# Altium schematic sheet CPU_PCIE_USB_HDMI_EXT_PCIEX2_mPCIeX2.SchDoc
size 594 x 420 mm; Scale: 1:1; DocumentType: Схема электрическая принципиальная; SheetNumber: 26; SheetTotal: 32; DocumentTypeShort: Э3; DocumentInvertoryNumber: ㅤ
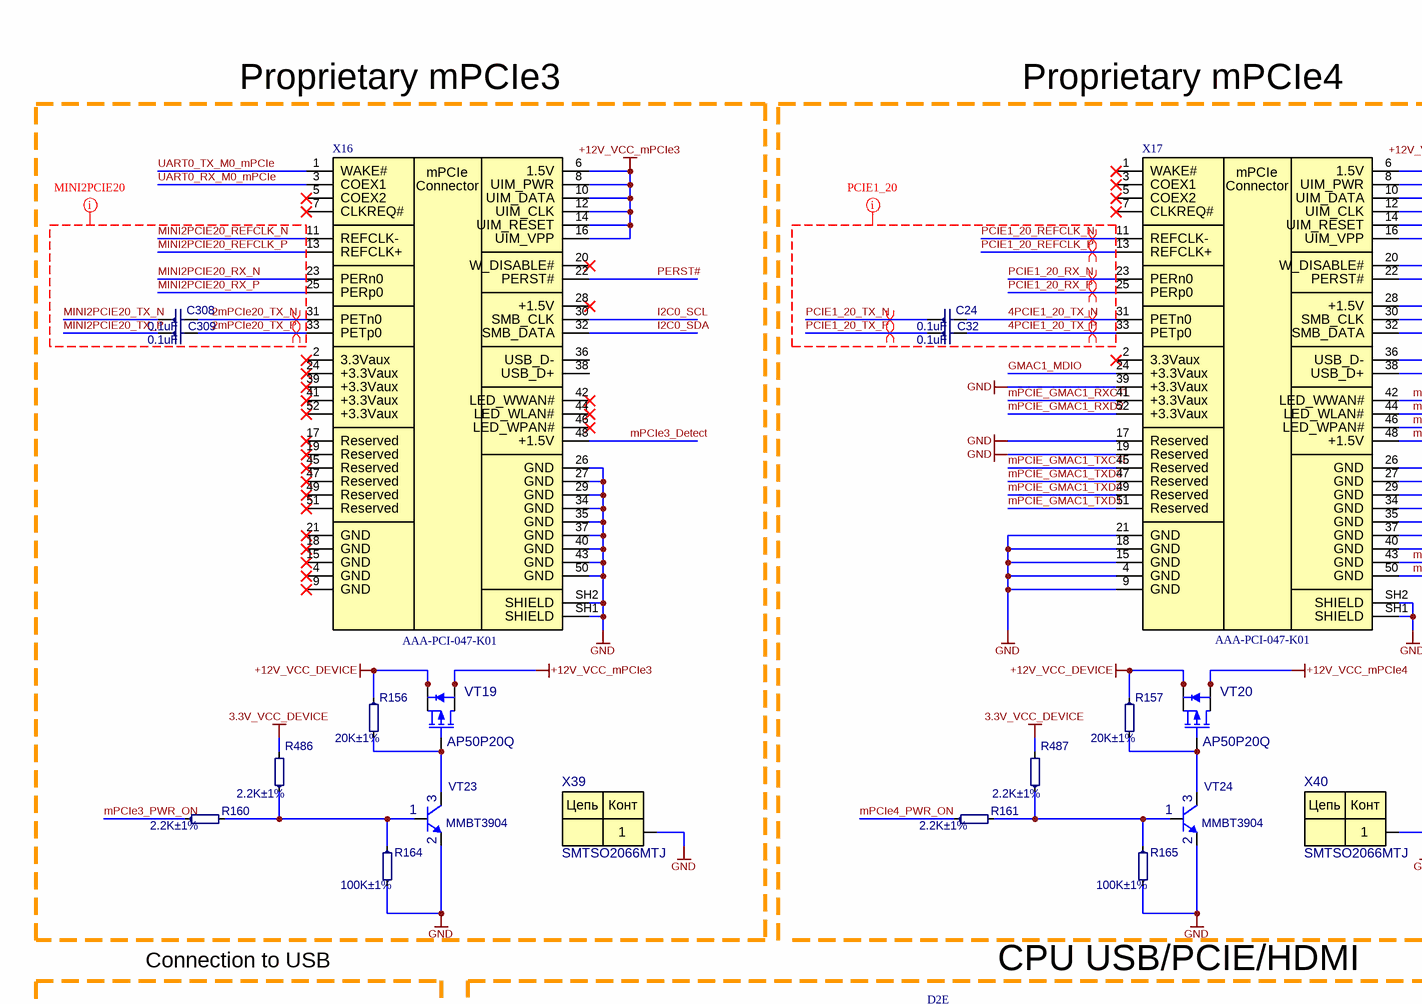
[diagram p0: CPU_PCIE_USB_HDMI_EXT_PCIEX2_mPCIeX2.SchDoc, top left]
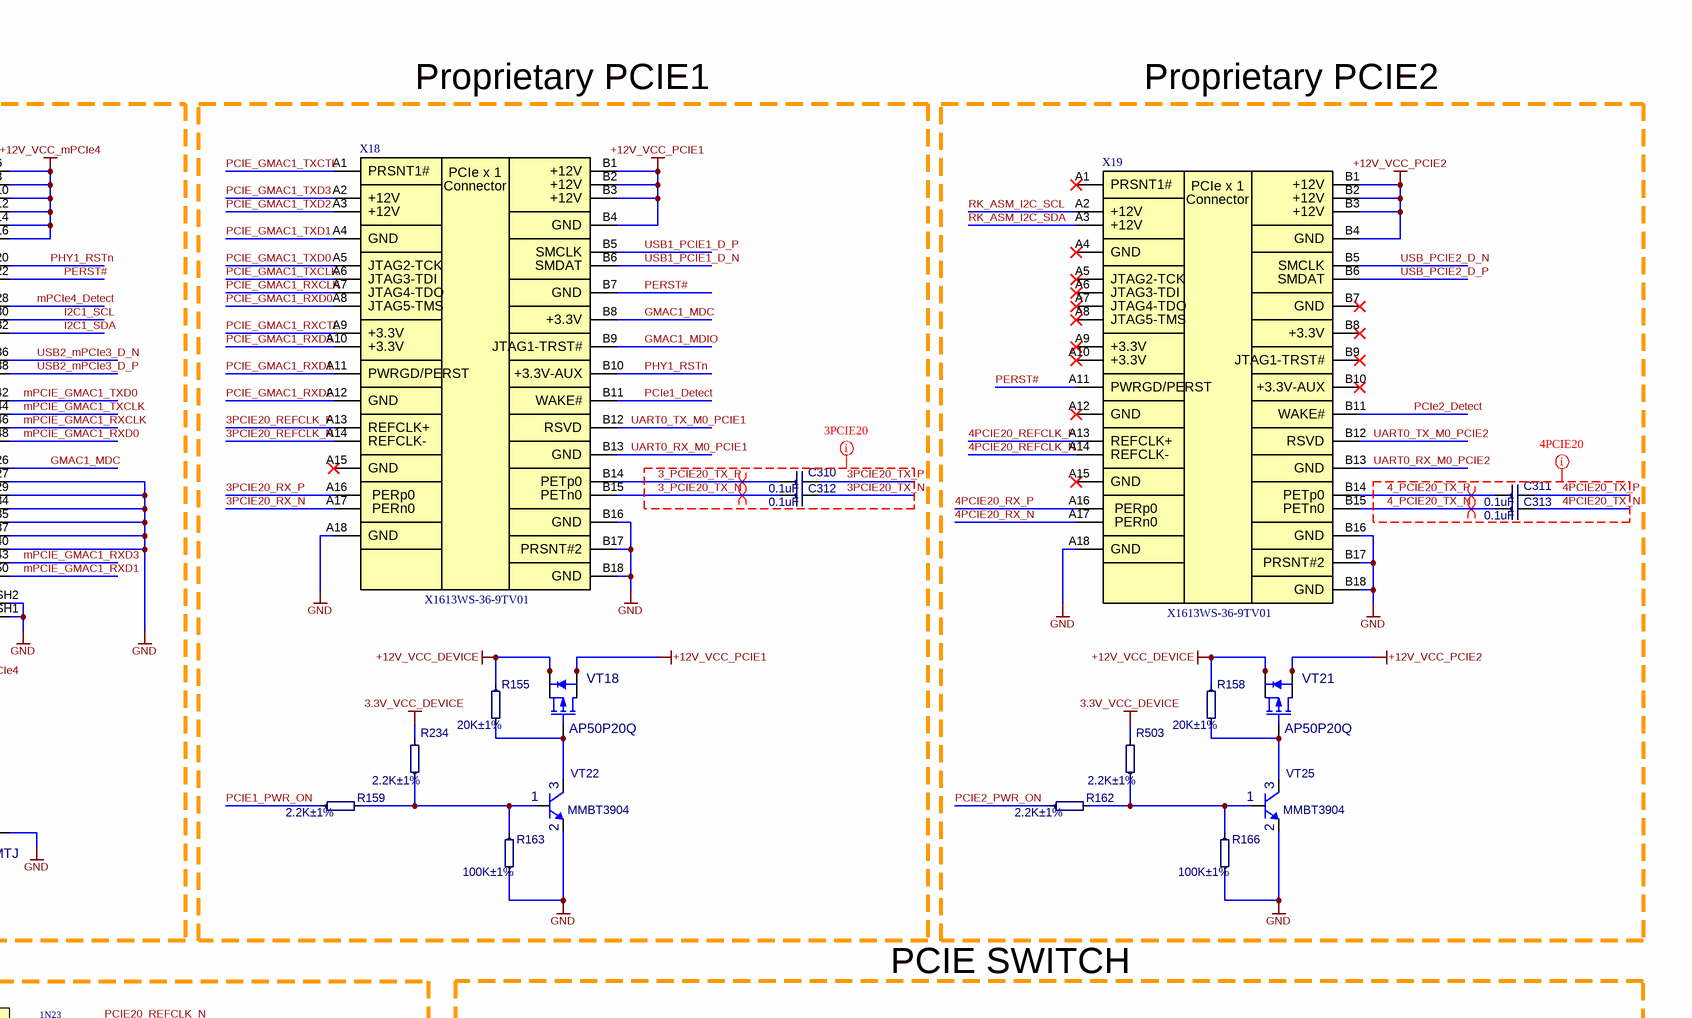
[diagram p1: CPU_PCIE_USB_HDMI_EXT_PCIEX2_mPCIeX2.SchDoc, top right]
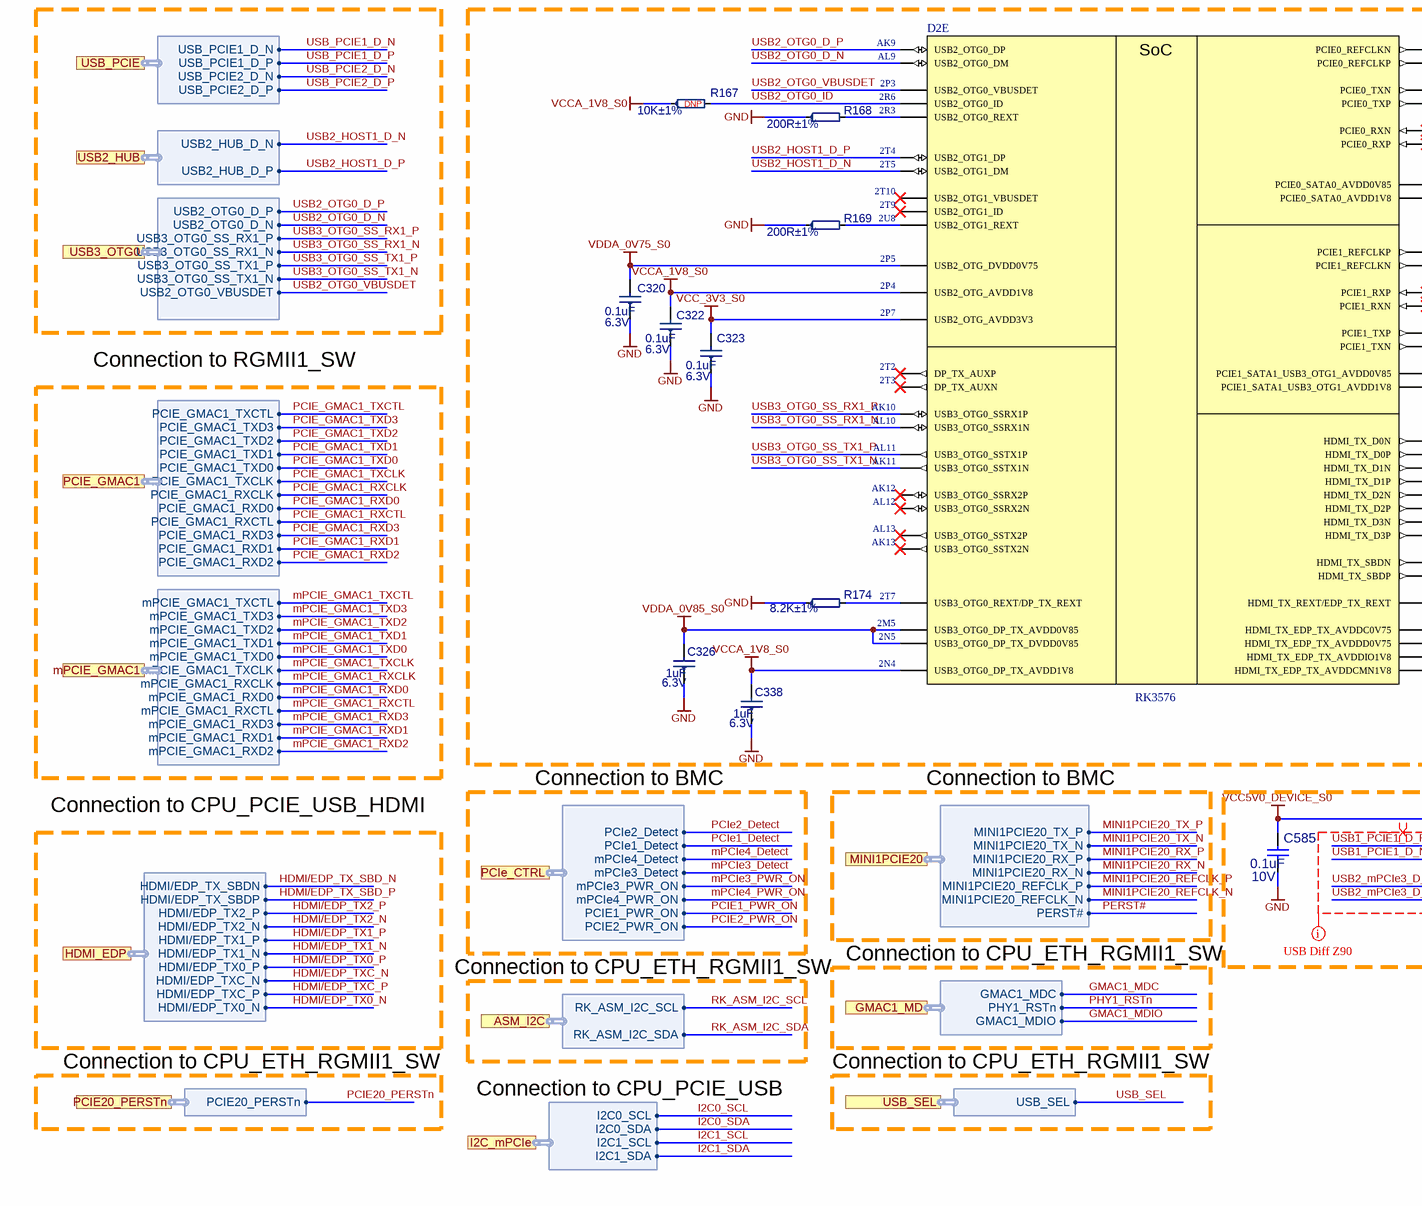
[diagram p2: CPU_PCIE_USB_HDMI_EXT_PCIEX2_mPCIeX2.SchDoc, bottom left]
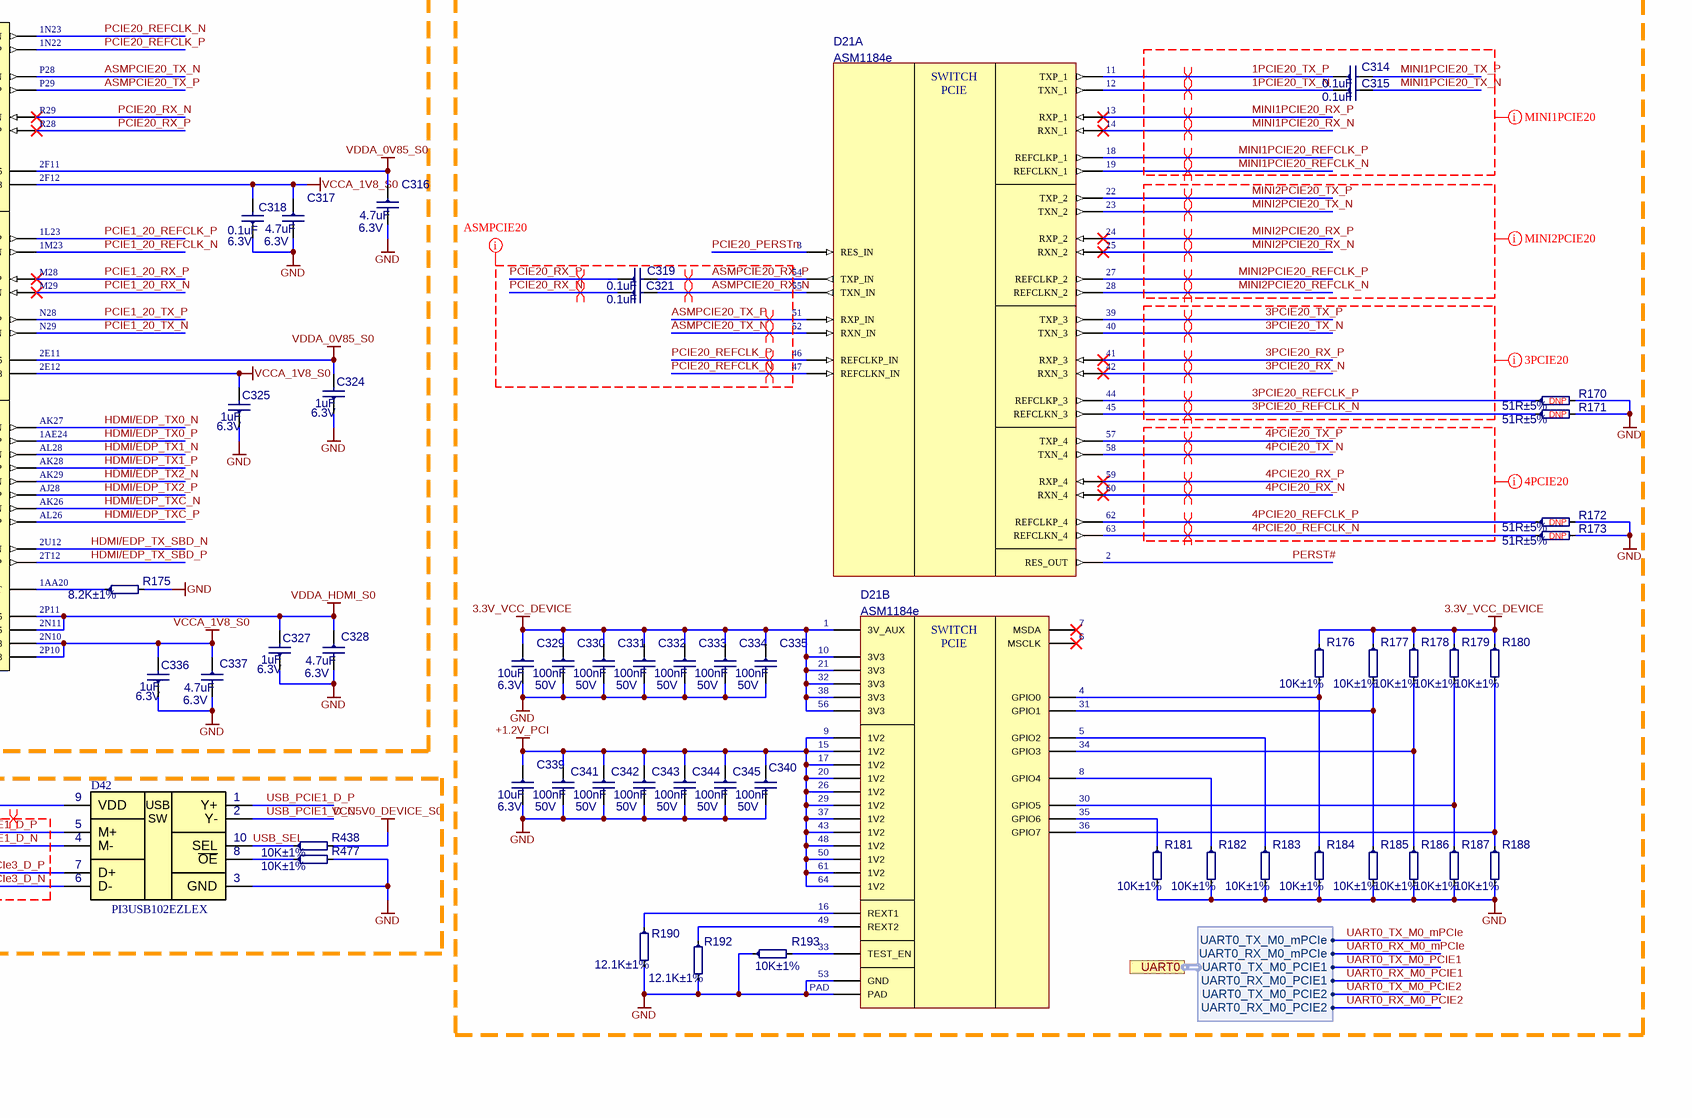
[diagram p3: CPU_PCIE_USB_HDMI_EXT_PCIEX2_mPCIeX2.SchDoc, bottom right]

## Parts
C24  0.1uF  [C0201]
C32  0.1uF  [C0201]
C308  0.1uF  [C0201]
C309  0.1uF  [C0201]
C310  0.1uF  [C0201]
C311  0.1uF  [C0201]
C312  0.1uF  [C0201]
C313  0.1uF  [C0201]
C314  0.1uF  [C0201]
C315  0.1uF  [C0201]
C316  4.7uF  Voltage: 6.3V  [C0201]
C317  4.7uF  Voltage: 6.3V  [C0201]
C318  0.1uF  Voltage: 6.3V  [C0201]
C319  0.1uF  [C0201]
C320  0.1uF  Voltage: 6.3V  [C0201]
C321  0.1uF  [C0201]
C322  0.1uF  Voltage: 6.3V  [C0201]
C323  0.1uF  Voltage: 6.3V  [C0201]
C324  1uF  Voltage: 6.3V  [C0201]
C325  1uF  Voltage: 6.3V  [C0201]
C326  1uF  Voltage: 6.3V  [C0201]
C327  1uF  Voltage: 6.3V  [C0201]
C328  4.7uF  Voltage: 6.3V  [C0201]
C329  10uF  Voltage: 6.3V  [C0402]
C330  100nF  Voltage: 50V  [C0402]
C331  100nF  Voltage: 50V  [C0402]
C332  100nF  Voltage: 50V  [C0402]
C333  100nF  Voltage: 50V  [C0402]
C334  100nF  Voltage: 50V  [C0402]
C335  100nF  Voltage: 50V  [C0402]
C336  1uF  Voltage: 6.3V  [C0201]
C337  4.7uF  Voltage: 6.3V  [C0201]
C338  1uF  Voltage: 6.3V  [C0201]
C339  10uF  Voltage: 6.3V  [C0402]
C340  100nF  Voltage: 50V  [C0402]
C341  100nF  Voltage: 50V  [C0402]
C342  100nF  Voltage: 50V  [C0402]
C343  100nF  Voltage: 50V  [C0402]
C344  100nF  Voltage: 50V  [C0402]
C345  100nF  Voltage: 50V  [C0402]
C585  0.1uF  Voltage: 10V  [C0402]
D2  RK3576  [BGAFCCSP698L]  (part E of 7)
D21  ASM1184e  [QFN50X90X90X09-64T75x75]  (parts A,B of 2)
D42  PI3USB102EZLEX  [PI3USB102EZLEX]
R155  20K±1%  [R0402]
R156  20K±1%  [R0402]
R157  20K±1%  [R0402]
R158  20K±1%  [R0402]
R159  2.2K±1%  [R0402]
R160  2.2K±1%  [R0402]
R161  2.2K±1%  [R0402]
R162  2.2K±1%  [R0402]
R163  100K±1%  [R0402]
R164  100K±1%  [R0402]
R165  100K±1%  [R0402]
R166  100K±1%  [R0402]
R167  10K±1%  [R0402]
R168  200R±1%  [R0402]
R169  200R±1%  [R0402]
R170  51R±5%  [R0402]
R171  51R±5%  [R0402]
R172  51R±5%  [R0402]
R173  51R±5%  [R0402]
R174  8.2K±1%  [R0402]
R175  8.2K±1%  [R0402]
R176  10K±1%  [R0402]
R177  10K±1%  [R0402]
R178  10K±1%  [R0402]
R179  10K±1%  [R0402]
R180  10K±1%  [R0402]
R181  10K±1%  [R0402]
R182  10K±1%  [R0402]
R183  10K±1%  [R0402]
R184  10K±1%  [R0402]
R185  10K±1%  [R0402]
R186  10K±1%  [R0402]
R187  10K±1%  [R0402]
R188  10K±1%  [R0402]
R190  12.1K±1%  [R0402]
R192  12.1K±1%  [R0402]
R193  10K±1%  [R0402]
R234  2.2K±1%  [R0402]
R438  10K±1%  [R0402]
R477  10K±1%  [R0402]
R486  2.2K±1%  [R0402]
R487  2.2K±1%  [R0402]
R503  2.2K±1%  [R0402]
VT18  AP50P20Q  [AP50P20Q]
VT19  AP50P20Q  [AP50P20Q]
VT20  AP50P20Q  [AP50P20Q]
VT21  AP50P20Q  [AP50P20Q]
VT22  MMBT3904  [SOT23]
VT23  MMBT3904  [SOT23]
VT24  MMBT3904  [SOT23]
VT25  MMBT3904  [SOT23]
X16  AAA-PCI-047-K01  [AAA-PCI-047-K01]
X17  AAA-PCI-047-K01  [AAA-PCI-047-K01]
X18  X1613WS-36-9TV01  [X1613WS-36-9TV01]
X19  X1613WS-36-9TV01  [X1613WS-36-9TV01]
X39  SMTSO2066MTJ  [SMTSO2066MTJ]
X40  SMTSO2066MTJ  [SMTSO2066MTJ]

## Ports
ASM_I2C (harness ASM_I2C), GMAC1_MD (harness GMAC1_MD), HDMI_EDP (harness HDMI_EDP), I2C_mPCIe (harness I2C_mPCIe), MINI1PCIE20 (harness MINI1PCIE20), mPCIE_GMAC1 (harness mPCIE_GMAC1), PCIE20_PERSTn (harness PCIE20_PERSTn), PCIe_CTRL (harness PCIe_CTRL), PCIE_GMAC1 (harness PCIE_GMAC1), UART0 (harness UART0), USB2_HUB (harness USB2_HUB), USB3_OTG0 (harness USB3_OTG0), USB_PCIE (harness USB_PCIE), USB_SEL (harness USB_SEL)

## Harnesses
PCIE_GMAC1: PCIE_GMAC1_TXD3, PCIE_GMAC1_TXD2, PCIE_GMAC1_TXD1, PCIE_GMAC1_TXCTL, PCIE_GMAC1_TXD0, PCIE_GMAC1_TXCLK, PCIE_GMAC1_RXCLK, PCIE_GMAC1_RXD0, PCIE_GMAC1_RXCTL, PCIE_GMAC1_RXD3, PCIE_GMAC1_RXD1, PCIE_GMAC1_RXD2
mPCIE_GMAC1: mPCIE_GMAC1_TXD3, mPCIE_GMAC1_TXD2, mPCIE_GMAC1_TXD1, mPCIE_GMAC1_TXCTL, mPCIE_GMAC1_TXD0, mPCIE_GMAC1_TXCLK, mPCIE_GMAC1_RXCLK, mPCIE_GMAC1_RXD0, mPCIE_GMAC1_RXCTL, mPCIE_GMAC1_RXD3, mPCIE_GMAC1_RXD1, mPCIE_GMAC1_RXD2
USB2_HUB: USB2_HUB_D_P, USB2_HUB_D_N
PCIe_CTRL: PCIe2_Detect, PCIe1_Detect, mPCIe4_Detect, mPCIe3_Detect, mPCIe3_PWR_ON, mPCIe4_PWR_ON, PCIE1_PWR_ON, PCIE2_PWR_ON
MINI1PCIE20: MINI1PCIE20_TX_N, MINI1PCIE20_RX_P, MINI1PCIE20_RX_N, MINI1PCIE20_TX_P, MINI1PCIE20_REFCLK_P, MINI1PCIE20_REFCLK_N, PERST#
PCIE20_PERSTn: PCIE20_PERSTn
HDMI_EDP: HDMI/EDP_TX2_N, HDMI/EDP_TX1_P, HDMI/EDP_TX1_N, HDMI/EDP_TX2_P, HDMI/EDP_TX0_P, HDMI/EDP_TXC_N, HDMI/EDP_TXC_P, HDMI/EDP_TX0_N, HDMI/EDP_TX_SBDN, HDMI/EDP_TX_SBDP
USB_PCIE: USB_PCIE1_D_P, USB_PCIE1_D_N, USB_PCIE2_D_P, USB_PCIE2_D_N
ASM_I2C: RK_ASM_I2C_SCL, RK_ASM_I2C_SDA
GMAC1_MD: GMAC1_MDC, GMAC1_MDIO, PHY1_RSTn
USB_SEL: USB_SEL
I2C_mPCIe: I2C0_SDA, I2C1_SCL, I2C0_SCL, I2C1_SDA
UART0: UART0_RX_M0_PCIE2, UART0_TX_M0_PCIE2, UART0_RX_M0_PCIE1, UART0_TX_M0_PCIE1, UART0_RX_M0_mPCIe, UART0_TX_M0_mPCIe
USB3_OTG0: USB3_OTG0_SS_RX1_P, USB3_OTG0_SS_RX1_N, USB3_OTG0_SS_TX1_P, USB2_OTG0_D_N, USB3_OTG0_SS_TX1_N, USB2_OTG0_VBUSDET, USB2_OTG0_D_P

## Nets
3.3V_VCC_DEVICE: C329.1 C330.1 C331.1 C332.1 C333.1 C334.1 C335.1 D21.1(3V_AUX) D21.10(3V3) D21.21(3V3) D21.32(3V3) D21.38(3V3) D21.56(3V3) R176.1 R177.1 R178.1 R179.1 R180.1 R234.2 R486.2 R487.2 R503.2
+1.2V_PCI: C339.1 C340.1 C341.1 C342.1 C343.1 C344.1 C345.1 D21.9(1V2) D21.15(1V2) D21.17(1V2) D21.20(1V2) D21.26(1V2) D21.29(1V2) D21.37(1V2) D21.43(1V2) D21.48(1V2) D21.50(1V2) D21.61(1V2) D21.64(1V2)
+12V_VCC_DEVICE: R155.1 R156.1 R157.1 R158.1 VT18.1 VT18.2 VT18.3 VT19.1 VT19.2 VT19.3 VT20.1 VT20.2 VT20.3 VT21.1 VT21.2 VT21.3
+12V_VCC_mPCIe3: VT19.5 VT19.6 VT19.7 VT19.8 X16.6(1.5V) X16.8(UIM_PWR) X16.10(UIM_DATA) X16.12(UIM_CLK) X16.14(UIM_RESET) X16.16(UIM_VPP)
+12V_VCC_mPCIe4: VT20.5 VT20.6 VT20.7 VT20.8 X17.6(1.5V) X17.8(UIM_PWR) X17.10(UIM_DATA) X17.12(UIM_CLK) X17.14(UIM_RESET) X17.16(UIM_VPP)
+12V_VCC_PCIE1: VT18.5 VT18.6 VT18.7 VT18.8 X18.B1(+12V) X18.B2(+12V) X18.B3(+12V) X18.B4(GND)
+12V_VCC_PCIE2: VT21.5 VT21.6 VT21.7 VT21.8 X19.B1(+12V) X19.B2(+12V) X19.B3(+12V) X19.B4(GND)
GND: C316.2 C317.2 C318.1 C320.1 C322.1 C323.1 C324.1 C325.1 C326.1 C327.1 C328.2 C329.2 C330.2 C331.2 C332.2 C333.2 C334.2 C335.2 C336.1 C337.2 C338.1 C339.2 C340.2 C341.2 C342.2 C343.2 C344.2 C345.2 C585.1 D21.53(GND) D21.PAD D42.3(GND) R163.2 R164.2 R165.2 R166.2 R168.1 R169.1 R170.2 R171.2 R172.2 R173.2 R174.1 R175.2 R181.2 R182.2 R183.2 R184.2 R185.2 R186.2 R187.2 R188.2 R190.2 R192.2 R193.1 R477.2 VT22.2(E) VT23.2(E) VT24.2(E) VT25.2(E) X16.26(GND) X16.27(GND) X16.29(GND) X16.34(GND) X16.35(GND) X16.37(GND) X16.40(GND) X16.43(GND) X16.50(GND) X16.SH1(SHIELD) X16.SH2(SHIELD) X17.4(GND) X17.9(GND) X17.15(GND) X17.17(Reserved) X17.18(GND) X17.19(Reserved) X17.21(GND) X17.27(GND) X17.29(GND) X17.34(GND) X17.35(GND) X17.37(GND) X17.39(+3.3Vaux) X17.40(GND) X17.SH1(SHIELD) X17.SH2(SHIELD) X18.A18(GND) X18.B16(GND) X18.B17(PRSNT#2) X18.B18(GND) X19.A18(GND) X19.B16(GND) X19.B17(PRSNT#2) X19.B18(GND) X39.1 X40.1
VCC5V0_DEVICE_S0: C585.2 D42.9(VDD) R438.2
VCC_3V3_S0: C323.2 D2.2P7(USB2_OTG_AVDD3V3)
VCCA_1V8_S0: C317.1 C318.2 C322.2 C325.2 C336.2 C337.1 C338.2 D2.2E12(PCIE1_SATA1_USB3_OTG1_AVDD1V8) D2.2F12(PCIE0_SATA0_AVDD1V8) D2.2N4(USB3_OTG0_DP_TX_AVDD1V8) D2.2N10(HDMI_TX_EDP_TX_AVDDIO1V8) D2.2P4(USB2_OTG_AVDD1V8) D2.2P10(HDMI_TX_EDP_TX_AVDDCMN1V8) R167.1
VDDA_0V75_S0: C320.2 D2.2P5(USB2_OTG_DVDD0V75)
VDDA_0V85_S0: C316.1 C324.2 C326.2 D2.2E11(PCIE1_SATA1_USB3_OTG1_AVDD0V85) D2.2F11(PCIE0_SATA0_AVDD0V85) D2.2M5(USB3_OTG0_DP_TX_AVDD0V85) D2.2N5(USB3_OTG0_DP_TX_DVDD0V85)
VDDA_HDMI_S0: C327.2 C328.1 D2.2N11(HDMI_TX_EDP_TX_AVDDD0V75) D2.2P11(HDMI_TX_EDP_TX_AVDDC0V75)
1PCIE20_TX_N: C315.1 D21.12(TXN_1)
1PCIE20_TX_P: C314.1 D21.11(TXP_1)
2mPCIe20_TX_N: C308.2 X16.31(PETn0)
2mPCIe20_TX_P: C309.2 X16.33(РЕТр0)
3_PCIE20_TX_N: C312.1 X18.B15(PETn0)
3_PCIE20_TX_P: C310.1 X18.B14(PETp0)
3PCIE20_REFCLK_N: D21.45(REFCLKN_3) R171.1 X18.A14(REFCLK-)
3PCIE20_REFCLK_P: D21.44(REFCLKP_3) R170.1 X18.A13(REFCLK+)
3PCIE20_RX_N: D21.42(RXN_3) X18.A17(PERn0)
3PCIE20_RX_P: D21.41(RXP_3) X18.A16(PERp0)
3PCIE20_TX_N: C312.2 D21.40(TXN_3)
3PCIE20_TX_P: C310.2 D21.39(TXP_3)
4_PCIE20_TX_N: C313.1 X19.B15(PETn0)
4_PCIE20_TX_P: C311.1 X19.B14(PETp0)
4PCIE1_20_TX_N: C24.2 X17.31(PETn0)
4PCIE1_20_TX_P: C32.2 X17.33(РЕТр0)
4PCIE20_REFCLK_N: D21.63(REFCLKN_4) R173.1 X19.A14(REFCLK-)
4PCIE20_REFCLK_P: D21.62(REFCLKP_4) R172.1 X19.A13(REFCLK+)
4PCIE20_RX_N: D21.60(RXN_4) X19.A17(PERn0)
4PCIE20_RX_P: D21.59(RXP_4) X19.A16(PERp0)
4PCIE20_TX_N: C313.2 D21.58(TXN_4)
4PCIE20_TX_P: C311.2 D21.57(TXP_4)
ASMPCIE20_RX_N: C321.2 D21.55(TXN_IN)
ASMPCIE20_RX_P: C319.2 D21.54(TXP_IN)
ASMPCIE20_TX_N: D2.P28(PCIE0_TXN) D21.52(RXN_IN)
ASMPCIE20_TX_P: D2.P29(PCIE0_TXP) D21.51(RXP_IN)
GMAC1_MDC: X17.26(GND) X18.B8(+3.3V) ; port GMAC1_MD.GMAC1_MDC
GMAC1_MDIO: X17.24(+3.3Vaux) X18.B9(JTAG1-TRST#) ; port GMAC1_MD.GMAC1_MDIO
HDMI/EDP_TX0_N: D2.AK27(HDMI_TX_D0N) ; port HDMI_EDP.HDMI/EDP_TX0_N
HDMI/EDP_TX0_P: D2.1AE24(HDMI_TX_D0P) ; port HDMI_EDP.HDMI/EDP_TX0_P
HDMI/EDP_TX1_N: D2.AL28(HDMI_TX_D1N) ; port HDMI_EDP.HDMI/EDP_TX1_N
HDMI/EDP_TX1_P: D2.AK28(HDMI_TX_D1P) ; port HDMI_EDP.HDMI/EDP_TX1_P
HDMI/EDP_TX2_N: D2.AK29(HDMI_TX_D2N) ; port HDMI_EDP.HDMI/EDP_TX2_N
HDMI/EDP_TX2_P: D2.AJ28(HDMI_TX_D2P) ; port HDMI_EDP.HDMI/EDP_TX2_P
HDMI/EDP_TX_SBD_N: D2.2U12(HDMI_TX_SBDN) ; port HDMI_EDP.HDMI/EDP_TX_SBDN
HDMI/EDP_TX_SBD_P: D2.2T12(HDMI_TX_SBDP) ; port HDMI_EDP.HDMI/EDP_TX_SBDP
HDMI/EDP_TXC_N: D2.AK26(HDMI_TX_D3N) ; port HDMI_EDP.HDMI/EDP_TXC_N
HDMI/EDP_TXC_P: D2.AL26(HDMI_TX_D3P) ; port HDMI_EDP.HDMI/EDP_TXC_P
I2C0_SCL: X16.30(SMB_CLK) ; port I2C_mPCIe.I2C0_SCL
I2C0_SDA: X16.32(SMB_DATA) ; port I2C_mPCIe.I2C0_SDA
I2C1_SCL: X17.30(SMB_CLK) ; port I2C_mPCIe.I2C1_SCL
I2C1_SDA: X17.32(SMB_DATA) ; port I2C_mPCIe.I2C1_SDA
MINI1PCIE20_REFCLK_N: D21.19(REFCLKN_1) ; port MINI1PCIE20.MINI1PCIE20_REFCLK_N
MINI1PCIE20_REFCLK_P: D21.18(REFCLKP_1) ; port MINI1PCIE20.MINI1PCIE20_REFCLK_P
MINI1PCIE20_RX_N: D21.14(RXN_1) ; port MINI1PCIE20.MINI1PCIE20_RX_N
MINI1PCIE20_RX_P: D21.13(RXP_1) ; port MINI1PCIE20.MINI1PCIE20_RX_P
MINI1PCIE20_TX_N: C315.2 ; port MINI1PCIE20.MINI1PCIE20_TX_N
MINI1PCIE20_TX_P: C314.2 ; port MINI1PCIE20.MINI1PCIE20_TX_P
MINI2PCIE20_REFCLK_N: D21.28(REFCLKN_2) X16.11(REFCLK-)
MINI2PCIE20_REFCLK_P: D21.27(REFCLKP_2) X16.13(REFCLK+)
MINI2PCIE20_RX_N: D21.25(RXN_2) X16.23(PERn0)
MINI2PCIE20_RX_P: D21.24(RXP_2) X16.25(PERp0)
MINI2PCIE20_TX_N: C308.1 D21.23(TXN_2)
MINI2PCIE20_TX_P: C309.1 D21.22(TXP_2)
mPCIe3_Detect: X16.48(+1.5V) ; port PCIe_CTRL.mPCIe3_Detect
mPCIe3_PWR_ON: R160.1 ; port PCIe_CTRL.mPCIe3_PWR_ON
mPCIe4_Detect: X17.28(+1.5V) ; port PCIe_CTRL.mPCIe4_Detect
mPCIe4_PWR_ON: R161.1 ; port PCIe_CTRL.mPCIe4_PWR_ON
mPCIE_GMAC1_RXCLK: X17.46(LED_WPAN#) ; port mPCIE_GMAC1.mPCIE_GMAC1_RXCLK
mPCIE_GMAC1_RXCTL: X17.41(+3.3Vaux) ; port mPCIE_GMAC1.mPCIE_GMAC1_RXCTL
mPCIE_GMAC1_RXD0: X17.48(+1.5V) ; port mPCIE_GMAC1.mPCIE_GMAC1_RXD0
mPCIE_GMAC1_RXD1: X17.50(GND) ; port mPCIE_GMAC1.mPCIE_GMAC1_RXD1
mPCIE_GMAC1_RXD2: X17.52(+3.3Vaux) ; port mPCIE_GMAC1.mPCIE_GMAC1_RXD2
mPCIE_GMAC1_RXD3: X17.43(GND) ; port mPCIE_GMAC1.mPCIE_GMAC1_RXD3
mPCIE_GMAC1_TXCLK: X17.44(LED_WLAN#) ; port mPCIE_GMAC1.mPCIE_GMAC1_TXCLK
mPCIE_GMAC1_TXCTL: X17.45(Reserved) ; port mPCIE_GMAC1.mPCIE_GMAC1_TXCTL
mPCIE_GMAC1_TXD0: X17.42(LED_WWAN#) ; port mPCIE_GMAC1.mPCIE_GMAC1_TXD0
mPCIE_GMAC1_TXD1: X17.51(Reserved) ; port mPCIE_GMAC1.mPCIE_GMAC1_TXD1
mPCIE_GMAC1_TXD2: X17.49(Reserved) ; port mPCIE_GMAC1.mPCIE_GMAC1_TXD2
mPCIE_GMAC1_TXD3: X17.47(Reserved) ; port mPCIE_GMAC1.mPCIE_GMAC1_TXD3
PCIE1_20_REFCLK_N: D2.1M23(PCIE1_REFCLKN) X17.11(REFCLK-)
PCIE1_20_REFCLK_P: D2.1L23(PCIE1_REFCLKP) X17.13(REFCLK+)
PCIE1_20_RX_N: D2.M29(PCIE1_RXN) X17.23(PERn0)
PCIE1_20_RX_P: D2.M28(PCIE1_RXP) X17.25(PERp0)
PCIE1_20_TX_N: C24.1 D2.N29(PCIE1_TXN)
PCIE1_20_TX_P: C32.1 D2.N28(PCIE1_TXP)
PCIe1_Detect: X18.B11(WAKE#) ; port PCIe_CTRL.PCIe1_Detect
PCIE1_PWR_ON: R159.1 ; port PCIe_CTRL.PCIE1_PWR_ON
PCIe2_Detect: X19.B11(WAKE#) ; port PCIe_CTRL.PCIe2_Detect
PCIE2_PWR_ON: R162.1 ; port PCIe_CTRL.PCIE2_PWR_ON
PCIE20_PERSTn: D21.3(RES_IN) ; port PCIE20_PERSTn.PCIE20_PERSTn
PCIE20_REFCLK_N: D2.1N23(PCIE0_REFCLKN) D21.47(REFCLKN_IN)
PCIE20_REFCLK_P: D2.1N22(PCIE0_REFCLKP) D21.46(REFCLKP_IN)
PCIE20_RX_N: C321.1 D2.R29(PCIE0_RXN)
PCIE20_RX_P: C319.1 D2.R28(PCIE0_RXP)
PCIE_GMAC1_RXCLK: X18.A7(JTAG4-TDO) ; port PCIE_GMAC1.PCIE_GMAC1_RXCLK
PCIE_GMAC1_RXCTL: X18.A9(+3.3V) ; port PCIE_GMAC1.PCIE_GMAC1_RXCTL
PCIE_GMAC1_RXD0: X18.A8(JTAG5-TMS) ; port PCIE_GMAC1.PCIE_GMAC1_RXD0
PCIE_GMAC1_RXD1: X18.A11(PWRGD/PERST) ; port PCIE_GMAC1.PCIE_GMAC1_RXD1
PCIE_GMAC1_RXD2: X18.A12(GND) ; port PCIE_GMAC1.PCIE_GMAC1_RXD2
PCIE_GMAC1_RXD3: X18.A10(+3.3V) ; port PCIE_GMAC1.PCIE_GMAC1_RXD3
PCIE_GMAC1_TXCLK: X18.A6(JTAG3-TDI) ; port PCIE_GMAC1.PCIE_GMAC1_TXCLK
PCIE_GMAC1_TXCTL: X18.A1(PRSNT1#) ; port PCIE_GMAC1.PCIE_GMAC1_TXCTL
PCIE_GMAC1_TXD0: X18.A5(JTAG2-TCK) ; port PCIE_GMAC1.PCIE_GMAC1_TXD0
PCIE_GMAC1_TXD1: X18.A4(GND) ; port PCIE_GMAC1.PCIE_GMAC1_TXD1
PCIE_GMAC1_TXD2: X18.A3(+12V) ; port PCIE_GMAC1.PCIE_GMAC1_TXD2
PCIE_GMAC1_TXD3: X18.A2(+12V) ; port PCIE_GMAC1.PCIE_GMAC1_TXD3
PERST#: D21.2(RES_OUT) X16.22(PERST#) X17.22(PERST#) X18.B7(GND) X19.A11(PWRGD/PERST) ; port MINI1PCIE20.PERST#
PHY1_RSTn: X17.20(W_DISABLE#) X18.B10(+3.3V-AUX) ; port GMAC1_MD.PHY1_RSTn
RK_ASM_I2C_SCL: X19.A2(+12V) ; port ASM_I2C.RK_ASM_I2C_SCL
RK_ASM_I2C_SDA: X19.A3(+12V) ; port ASM_I2C.RK_ASM_I2C_SDA
UART0_RX_M0_mPCIe: X16.3(СОЕХ1) ; port UART0.UART0_RX_M0_mPCIe
UART0_RX_M0_PCIE1: X18.B13(GND) ; port UART0.UART0_RX_M0_PCIE1
UART0_RX_M0_PCIE2: X19.B13(GND) ; port UART0.UART0_RX_M0_PCIE2
UART0_TX_M0_mPCIe: X16.1(WAKE#) ; port UART0.UART0_TX_M0_mPCIe
UART0_TX_M0_PCIE1: X18.B12(RSVD) ; port UART0.UART0_TX_M0_PCIE1
UART0_TX_M0_PCIE2: X19.B12(RSVD) ; port UART0.UART0_TX_M0_PCIE2
USB1_PCIE1_D_N: D42.4(M-) X18.B6(SMDAT)
USB1_PCIE1_D_P: D42.5(M+) X18.B5(SMCLK)
USB2_HOST1_D_N: D2.2T5(USB2_OTG1_DM) ; port USB2_HUB.USB2_HUB_D_N
USB2_HOST1_D_P: D2.2T4(USB2_OTG1_DP) ; port USB2_HUB.USB2_HUB_D_P
USB2_mPCIe3_D_N: D42.6(D-) X17.36(USB_D-)
USB2_mPCIe3_D_P: D42.7(D+) X17.38(USB_D+)
USB2_OTG0_D_N: D2.AL9(USB2_OTG0_DM) ; port USB3_OTG0.USB2_OTG0_D_N
USB2_OTG0_D_P: D2.AK9(USB2_OTG0_DP) ; port USB3_OTG0.USB2_OTG0_D_P
USB2_OTG0_ID: D2.2R6(USB2_OTG0_ID) R167.2
USB2_OTG0_VBUSDET: D2.2P3(USB2_OTG0_VBUSDET) ; port USB3_OTG0.USB2_OTG0_VBUSDET
USB3_OTG0_SS_RX1_N: D2.AL10(USB3_OTG0_SSRX1N) ; port USB3_OTG0.USB3_OTG0_SS_RX1_N
USB3_OTG0_SS_RX1_P: D2.AK10(USB3_OTG0_SSRX1P) ; port USB3_OTG0.USB3_OTG0_SS_RX1_P
USB3_OTG0_SS_TX1_N: D2.AK11(USB3_OTG0_SSTX1N) ; port USB3_OTG0.USB3_OTG0_SS_TX1_N
USB3_OTG0_SS_TX1_P: D2.AL11(USB3_OTG0_SSTX1P) ; port USB3_OTG0.USB3_OTG0_SS_TX1_P
USB_PCIE1_D_N: D42.2(Y-) ; port USB_PCIE.USB_PCIE1_D_N
USB_PCIE1_D_P: D42.1(Y+) ; port USB_PCIE.USB_PCIE1_D_P
USB_PCIE2_D_N: X19.B5(SMCLK) ; port USB_PCIE.USB_PCIE2_D_N
USB_PCIE2_D_P: X19.B6(SMDAT) ; port USB_PCIE.USB_PCIE2_D_P
USB_SEL: D42.10(SEL) R438.1 ; port USB_SEL.USB_SEL
NetD2_1AA20: D2.1AA20(HDMI_TX_REXT/EDP_TX_REXT) R175.1
NetD2_2R3: D2.2R3(USB2_OTG0_REXT) R168.2
NetD2_2T7: D2.2T7(USB3_OTG0_REXT/DP_TX_REXT) R174.2
NetD2_2U8: D2.2U8(USB2_OTG1_REXT) R169.2
NetD21_4: D21.4(GPIO0) R176.2 R184.1
NetD21_5: D21.5(GPIO2) R183.1
NetD21_8: D21.8(GPIO4) R182.1
NetD21_16: D21.16(REXT1) R190.1
NetD21_30: D21.30(GPIO5) R179.2 R187.1
NetD21_31: D21.31(GPIO1) R177.2 R185.1
NetD21_33: D21.33(TEST_EN) R193.2
NetD21_34: D21.34(GPIO3) R178.2 R186.1
NetD21_35: D21.35(GPIO6) R181.1
NetD21_36: D21.36(GPIO7) R180.2 R188.1
NetD21_49: D21.49(REXT2) R192.1
NetD42_8: D42.8(~{OE}) R477.1
NetR155_2: R155.2 VT18.4 VT22.3(C)
NetR156_2: R156.2 VT19.4 VT23.3(C)
NetR157_2: R157.2 VT20.4 VT24.3(C)
NetR158_2: R158.2 VT21.4 VT25.3(C)
NetR159_2: R159.2 R163.1 R234.1 VT22.1(B)
NetR160_2: R160.2 R164.1 R486.1 VT23.1(B)
NetR161_2: R161.2 R165.1 R487.1 VT24.1(B)
NetR162_2: R162.2 R166.1 R503.1 VT25.1(B)

Not connected (* = marked no-connect by the designer): D2 2T2(DP_TX_AUXP)* 2T3(DP_TX_AUXN)* 2T9(USB2_OTG1_ID)* 2T10(USB2_OTG1_VBUSDET)* AK12(USB3_OTG0_SSRX2P)* AK13(USB3_OTG0_SSTX2N)* AL12(USB3_OTG0_SSRX2N)* AL13(USB3_OTG0_SSTX2P)*; D21 6(MSCLK)* 7(MSDA)*; X16 2(3.3Vaux)* 4(GND)* 5(СОЕХ2)* 7(CLKREQ#)* 9(GND)* 15(GND)* 17(Reserved)* 18(GND)* 19(Reserved)* 20(W_DISABLE#)* 21(GND)* 24(+3.3Vaux)* 28(+1.5V)* 36(USB_D-) 38(USB_D+) 39(+3.3Vaux)* 41(+3.3Vaux)* 42(LED_WWAN#)* 44(LED_WLAN#)* 45(Reserved)* 46(LED_WPAN#)* 47(Reserved)* 49(Reserved)* 51(Reserved)* 52(+3.3Vaux)*; X17 1(WAKE#)* 2(3.3Vaux)* 3(СОЕХ1)* 5(СОЕХ2)* 7(CLKREQ#)*; X18 A15(GND)*; X19 A1(PRSNT1#)* A4(GND)* A5(JTAG2-TCK)* A6(JTAG3-TDI)* A7(JTAG4-TDO)* A8(JTAG5-TMS_)* A9(+3.3V)* A10(+3.3V)* A12(GND)* A15(GND)* B7(GND)* B8(+3.3V)* B9(JTAG1-TRST#)* B10(+3.3V-AUX)*

## Layout directives
net class ASMPCIE20: ASMPCIE20_RX_N, ASMPCIE20_RX_P, ASMPCIE20_TX_N, ASMPCIE20_TX_P, PCIE20_REFCLK_N, PCIE20_REFCLK_P, PCIE20_RX_N, PCIE20_RX_P
net class MINI1PCIE20: 1PCIE20_TX_N, 1PCIE20_TX_P, MINI1PCIE20_REFCLK_N, MINI1PCIE20_REFCLK_P, MINI1PCIE20_RX_N, MINI1PCIE20_RX_P, MINI1PCIE20_TX_N, MINI1PCIE20_TX_P
net class USB: USB1_PCIE1_D_N, USB1_PCIE1_D_P, USB2_mPCIe3_D_N, USB2_mPCIe3_D_P
differential pair; differential pair class Diff_Z85: 1PCIE20_TX_N, 1PCIE20_TX_P, 2mPCIe20_TX_N, 2mPCIe20_TX_P, 3_PCIE20_TX_N, 3_PCIE20_TX_P, 3PCIE20_RX_N, 3PCIE20_RX_P, 3PCIE20_TX_N, 3PCIE20_TX_P, 4_PCIE20_TX_N, 4_PCIE20_TX_P, 4PCIE1_20_TX_N, 4PCIE1_20_TX_P, 4PCIE20_RX_N, 4PCIE20_RX_P, 4PCIE20_TX_N, 4PCIE20_TX_P, ASMPCIE20_RX_N, ASMPCIE20_RX_P, ASMPCIE20_TX_N, ASMPCIE20_TX_P, MINI1PCIE20_RX_N, MINI1PCIE20_RX_P, MINI2PCIE20_RX_N, MINI2PCIE20_RX_P, MINI2PCIE20_TX_N, MINI2PCIE20_TX_P, PCIE1_20_RX_N, PCIE1_20_RX_P, PCIE1_20_TX_N, PCIE1_20_TX_P, PCIE20_RX_N, PCIE20_RX_P
differential pair; differential pair class Diff_Z100: 3PCIE20_REFCLK_N, 3PCIE20_REFCLK_P, 4PCIE20_REFCLK_N, 4PCIE20_REFCLK_P, MINI1PCIE20_REFCLK_N, MINI1PCIE20_REFCLK_P, MINI2PCIE20_REFCLK_N, MINI2PCIE20_REFCLK_P, PCIE1_20_REFCLK_N, PCIE1_20_REFCLK_P, PCIE20_REFCLK_N, PCIE20_REFCLK_P
net class MINI2PCIE20: 2mPCIe20_TX_N, 2mPCIe20_TX_P, MINI2PCIE20_REFCLK_N, MINI2PCIE20_REFCLK_P, MINI2PCIE20_RX_N, MINI2PCIE20_RX_P, MINI2PCIE20_TX_N, MINI2PCIE20_TX_P
net class 3PCIE20: 3_PCIE20_TX_N, 3_PCIE20_TX_P, 3PCIE20_REFCLK_N, 3PCIE20_REFCLK_P, 3PCIE20_RX_N, 3PCIE20_RX_P, 3PCIE20_TX_N, 3PCIE20_TX_P
net class 4PCIE20: 4_PCIE20_TX_N, 4_PCIE20_TX_P, 4PCIE20_REFCLK_N, 4PCIE20_REFCLK_P, 4PCIE20_RX_N, 4PCIE20_RX_P, 4PCIE20_TX_N, 4PCIE20_TX_P
net class PCIE1_20: 4PCIE1_20_TX_N, 4PCIE1_20_TX_P, PCIE1_20_REFCLK_N, PCIE1_20_REFCLK_P, PCIE1_20_RX_N, PCIE1_20_RX_P, PCIE1_20_TX_N, PCIE1_20_TX_P
differential pair; differential pair class Diff_Z90: USB1_PCIE1_D_N, USB1_PCIE1_D_P, USB2_mPCIe3_D_N, USB2_mPCIe3_D_P

## Notes on the sheet
- Proprietary mPCIe3
- Proprietary mPCIe4
- Proprietary PCIE1
- Proprietary PCIE2
- Connection to USB
- CPU USB/PCIE/HDMI
- PCIE SWITCH
- (near R167) DNP
- Connection to RGMII1_SW
- (near R170) DNP
- (near R171) DNP
- (near R172) DNP
- (near R173) DNP
- Connection to CPU_PCIE_USB_HDMI
- Connection to BMC
- Connection to CPU_ETH_RGMII1_SW
- Connection to CPU_PCIE_USB
- Подп. и дата
- Инв. № дубл.
- Взам. инв. №
- Инв. № подл.
- Изм.
- Лист
- № докум.
- Подп.
- Дата
- Копировал
- Формат А2
- (in symbol AAA-PCI-047-K01) mPCIe; Connector
- (in symbol ASM1184e, part A) SWITCH; PCIE
- (in symbol ASM1184e, part B) SWITCH; PCIE
- (in symbol PI3USB102EZLEX) USB; SW
- (in symbol RK3576, part E) SoC
- (in symbol SMTSO2066MTJ) Цепь; Конт
- (in symbol X1613WS-36-9TV01) PCIe x 1; Connector

## Library data of the parts
C24 C32 C308-C315 C319 C321 = 0201-X5R-25V-0.1uF±10%: Manufacturer: Yageo; NameFromManufacturer: CC0201KRX5R8BB104; Dielectric: X5R; Voltage: 25V; Place: *); Tolerance: 10%; Check: False; Case: C0201; Part Number: 0201-X5R-25V-0.1uF±10%; Value: 0.1uF; Temperature: -55°C~85°C; ComponentLink2Description: Link to datasheet; ComponentLink1Description: DATASHEET; ComponentLink2URL: https://octopart.com/cc0201krx5r8bb104-yageo-88496683?r=sp; ComponentLink1URL: Datasheets/capacitors/UPY-GPHC_X5R_4V-to-50V_26.pdf; Last changed: 27.10.2022
C316 C317 C328 C337 = 0201-X5R-6.3V-4.7uF±20%: Manufacturer: Murata Electronics; NameFromManufacturer: GRM035R60J475ME15D; Dielectric: X5R; Place: *); Tolerance: 20%; Check: False; Case: C0201; Part Number: 0201-X5R-6.3V-4.7uF±20%; Value: 4.7uF; Temperature: -55°C~85°C; ComponentLink2Description: Link to datasheet; ComponentLink1Description: DATASHEET; ComponentLink2URL: https://www.terraelectronica.ru/product/2272938; ComponentLink1URL: Datasheets/capacitors/GRM035R60J475ME15-01A.pdf; Last changed: 27.10.2022
C318 C320 C322 C323 = 0201-X5R-6.3V-0.1uF±10%: Manufacturer: Yageo; NameFromManufacturer: CC0201KRX5R5BB104; Dielectric: X5R; Place: *); Tolerance: 10%; Check: False; Case: C0201; Part Number: 0201-X5R-6.3V-0.1uF±10%; Value: 0.1uF; Temperature: -55°C~85°C; ComponentLink2Description: Link to datasheet; ComponentLink1Description: DATASHEET; ComponentLink2URL: https://www.terraelectronica.ru/product/1020032; ComponentLink1URL: Datasheets/capacitors/UPY-GPHC_X5R_4V-to-50V_27.pdf; Last changed: 27.10.2022
C324-C327 C336 C338 = 0201-X5R-6.3V-1uF±20%: Manufacturer: Murata Electronics; NameFromManufacturer: GRM033R60J105MEA2D; Dielectric: X5R; Place: *); Tolerance: 20%; Check: False; Case: C0201; Part Number: 0201-X5R-6.3V-1uF±20%; Value: 1uF; Temperature: -55°C~85°C; ComponentLink2Description: Link to datasheet; ComponentLink1Description: DATASHEET; ComponentLink2URL: https://www.terraelectronica.ru/product/1209278; ComponentLink1URL: Datasheets/capacitors/GRM033R60J105MEA2-61A.pdf; Last changed: 27.10.2022
C329 C339 = 0402-X5R-6.3V-10uF±20%: Manufacturer: Yageo; NameFromManufacturer: CC0402MRX5R5BB106; Dielectric: X5R; Place: *); Tolerance: 20%; Check: False; Case: C0402; Part Number: 0402-X5R-6.3V-10uF±20%; Value: 10uF; Temperature: -55°C~125°C; ComponentLink2Description: Link to datasheet; ComponentLink1Description: DATASHEET; ComponentLink2URL: https://ru.mouser.com/ProductDetail/YAGEO/CC0402MRX5R5BB106?qs=%2Fha2pyFadujQAk9rG2cgJj8l7IbODD3KVaDjvxAcKzu9LtlLnRlq6Q%3D%3D; ComponentLink1URL: Datasheets/capacitors/UPY-GPHC_X5R_4V-to-50V_27.pdf; Last changed: 27.10.2022
C330-C335 C340-C345 = 0402-X7R-50V-0.1uF±10%: Ceramic Capacitor 0402 100nF ±10% 50V X7R; Manufacturer: Yageo; NameFromManufacturer: CC0402KRX7R9BB104; Place: *); Check: False; Dielectric: X7R; Case: C0402; Part Number: 0402-X7R-50V-0.1uF±10%; Value: 100nF; Tolerance: 10%; Temperature: -55°C~125°C; ComponentLink2Description: Link to datasheet; ComponentLink1Description: DATASHEET; ComponentLink2URL: https://www.lcsc.com/product-detail/Multilayer-Ceramic-Capacitors-MLCC-SMD-SMT_YAGEO-CC0402KRX7R9BB104_C131394.html; Last changed: 09.04.2025
C585 = 0402-X7R-16V-0.1uF±10%: Part Number: 0402-X5R-10V-0.1uF±10%; Manufacturer: Yageo; NameFromManufacturer: CC0402KRX5R6BB104; Place: S; Tolerance: 10%; Check: False; Value: 0.1uF; Temperature: -55°C~125°C; ComponentLink2Description: Link to datasheet; ComponentLink1Description: DATASHEET; Last changed: 27.10.2022
D2 = RK3576: SoC 4xCortex-A72@2.2Ghz+4xCortex-A53@2Ghz, LPDDR4/4X/5/5X, SDIO/eMMC/UFS/FSPI, BGA 16.1x17.2x1.0mm; Manufacturer: Rockship; Place: *); Check: False; Part Number: RK3576; Temperature: -40°C~85°C; Value: RK3576; ComponentLink1Description: DATASHEET; NameFromManufacturer: RK3576; ComponentLink1URL: https://wiki.friendlyelec.com/wiki/images/b/bf/Rockchip_RK3576_Datasheet_V1.5-20241216.pdf; Last changed: 06.01.2026
D21 = ASM1184e: Interface PCIE switch, PCIEx1 to 4xPCIEx1, 3.0V~3.6V, QFN-64 9.0x9.0x0.9mm 0.5mm pitch; Manufacturer: ASMedia; Place: *); Check: False; Part Number: ASM1184e; Temperature: 0°C~95°C; Value: ASM1184e; ComponentLink1Description: DATASHEET; NameFromManufacturer: ASM1184e; Last changed: 26.01.2026
D42 = PI3USB102EZLEX: USB 2.0 High-Speed (480 Mbps)  Switch with 5V Protection; Manufacturer: Diodes; Check: False; Part Number: PI3USB102EZLEX; NameFromManufacturer: PI3USB102EZLEX; Value: PI3USB102EZLEX
R155-R158 = 0402-0.0625W-20K-100ppm±1%: Chip Resistor 0402 20kΩ ±1% 50V ±100ppm/℃ Thick Film; NameFromManufacturer: RC0402FR-0720KL; Manufacturer: Yageo; Place: *); Value: 20K; Check: False; Case: R0402; Part Number: 0402-0.0625W-20K-100ppm±1%; Tolerance: 1%; Temperature: -55°C~155°C; ComponentLink1Description: DATASHEET; ComponentLink1URL: https://www.terraelectronica.ru/product/506449; Datasheet: Datasheets/resistors/PYu-RC_Group_51_RoHS_L_11.pdf; Last changed: 27.10.2022
R159-R162 R234 R486 R487 R503 = 0402-0.0625W-2.2K-100ppm±1%: *; NameFromManufacturer: RC0402FR-072K2L; Manufacturer: Yageo; Place: *); Value: 2.2K; Tolerance: 1%; Check: False; Case: R0402; Part Number: 0402-0.0625W-2.2K-100ppm±1%; Temperature: -55°C~155°C; ComponentLink1Description: DATASHEET; ComponentLink1URL: https://www.compel.ru/infosheet/YAG/SR0402FR-072K2L; Datasheet: Datasheets/resistors/PYu-SR_D_F tol_RoHS_L_5.pdf; Last changed: 27.10.2022
R163-R166 = 0402-0.0625W-100K-100ppm±1%: Chip Resistor 0402 100kΩ ±1% 50V ±100ppm/℃ Thick Film; NameFromManufacturer: RC0402FR-07100KL; Manufacturer: Yageo; Place: *); Value: 100K; Check: False; Case: R0402; Part Number: 0402-0.0625W-100K-100ppm±1%; Tolerance: 1%; Temperature: -55°C~155°C; ComponentLink1Description: DATASHEET; ComponentLink1URL: https://www.yageo.com/upload/media/product/productsearch/datasheet/rchip/PYu-RC_Group_51_RoHS_L_11.pdf; Datasheet: Datasheets/resistors/PYu-RC_Group_51_RoHS_L_11.pdf; Last changed: 27.10.2022
R167 R176-R188 R193 R438 R477 = 0402-0.0625W-10K-100ppm±1%: Chip Resistor 0402 10kΩ ±1% 50V ±100ppm/℃ Thick Film; NameFromManufacturer: RC0402FR-0710KL; Manufacturer: Yageo; Place: *); Value: 10K; Check: False; Case: R0402; Part Number: 0402-0.0625W-10K-100ppm±1%; Tolerance: 1%; Temperature: -55°C~155°C; ComponentLink1Description: DATASHEET; ComponentLink1URL: https://ru.mouser.com/ProductDetail/YAGEO/RC0402FR-0710KL?qs=%2Fha2pyFaduhjtLcYvKXQ8IogF7YwN7YtH%252BOO8ZtEEMnoa4yoWYcwpw%3D%3D; Datasheet: Datasheets/resistors/PYu-RC_Group_51_RoHS_L_11.pdf; Last changed: 27.10.2022
R168 R169 = 0402-0.0625W-200R-100ppm±1%: NameFromManufacturer: CRCW0402200RFKED; Manufacturer: Vishay Intertechnology Inc.; Place: *); Value: 200R; Tolerance: 1%; Check: False; Case: R0402; Part Number: 0402-0.0625W-200R-100ppm±1%; Temperature: -55°C~155°C; ComponentLink1Description: DATASHEET; ComponentLink1URL: https://www.terraelectronica.ru/product/683043; Datasheet: Datasheets/resistors/dcrcwe3.pdf; Last changed: 27.10.2022
R170-R173 = 0402-0.0625W-51R-200ppm±5%: *; NameFromManufacturer: RC0402JR-0751RP; Manufacturer: Yageo; Place: *); Value: 51R; Tolerance: 5%; Check: False; Case: R0402; Part Number: 0402-0.0625W-51R-200ppm±5%; Temperature: -55°C~155°C; ComponentLink1Description: DATASHEET; ComponentLink1URL: https://octopart.com/rc0402jr-0751rp-yageo-47616059?r=sp; Datasheet: Datasheets/resistors/yago_s_a0006248068_1-2286728.pdf; Last changed: 27.10.2022
R174 R175 = 0402-0.0625W-8.2K-100ppm±1%: NameFromManufacturer: RC0402FR-078K2L; Manufacturer: Yageo; Place: *); Value: 8.2K; Tolerance: 1%; Check: False; Case: R0402; Part Number: 0402-0.0625W-8.2K-100ppm±1%; Temperature: -55°C~155°C; ComponentLink1Description: DATASHEET; ComponentLink1URL: https://www.compel.ru/infosheet/YAG/RC0402FR-078K2L; Datasheet: Datasheets/resistors/PYu-RC_Group_51_RoHS_L_11.pdf; Last changed: 27.10.2022
R190 R192 = 0402-0.0625W-12.1K-100ppm±1%: Chip Resistor 0402 12.1kΩ ±1% 50V ±100ppm/℃ Thick Film; NameFromManufacturer: RC0402FR-0712K1L; Manufacturer: Yageo; Place: *); Value: 12.1K; Check: False; Case: R0402; Part Number: 0402-0.0625W-12.1K-100ppm±1%; Tolerance: 1%; Temperature: -55°C~155°C; ComponentLink1Description: DATASHEET; ComponentLink1URL: https://www.digikey.com/en/products/detail/yageo/RC0402FR-0712K1L/726533; Datasheet: Datasheets/resistors/PYu-RC_Group_51_RoHS_L_11.pdf; Last changed: 27.10.2022
VT18-VT21 = AP50P20Q: 20V 50A 40W 6.6mΩ@4.5V,15A 650mV@250uA P Channel WDFN-8(3x3) MOSFETs; Manufacturer: ALLPOWER; Check: False; Part Number: AP50P20Q; Value: AP50P20Q; NameFromManufacturer: AP50P20Q
VT22-VT25 = MMBT3904: NPN transistor; Manufacturer: Diotec Semiconductor; Place: S; Voltage: 40V; Check: False; Part Number: MMBT3904; Value: MMBT3904; Temperature: -55°C~150°C; ComponentLink1Description: DATASHEET; NameFromManufacturer: MMBT3904; ComponentLink1URL: https://www.terraelectronica.ru/product/607582; Datasheet: Datasheets/transistors/mmbt3904.pdf; Last changeв: 27.10.2022
X16 X17 = AAA-PCI-047-K01: mPCI-E Surface Mount 52 SMD,P=0.8mm Card Edge Connectors; Manufacturer: LOTES; Place: S; Check: False; Value: AAA-PCI-047-K01; Part Number: AAA-PCI-047-K01; NameFromManufacturer: AAA-PCI-047-K01; ComponentLink1Description: DATASHEET; Last changed: 24.03.2023
X18 X19 = X1613WS-36-9TV01: Clamp Plate 36P Through Hole,P=1mm Pluggable Connector Assemblies ROHS; Manufacturer: XKB Connection; Check: False; Value: X1613WS-36-9TV01; Part Number: X1613WS-36-9TV01; NameFromManufacturer: X1613WS-36-9TV01
X39 X40 = SMTSO2066MTJ: Manufacturer: Sinhoo; Check: False; Part Number: SMTSO2066MTJ; Value: SMTSO2066MTJ; NameFromManufacturer: SMTSO2066MTJ